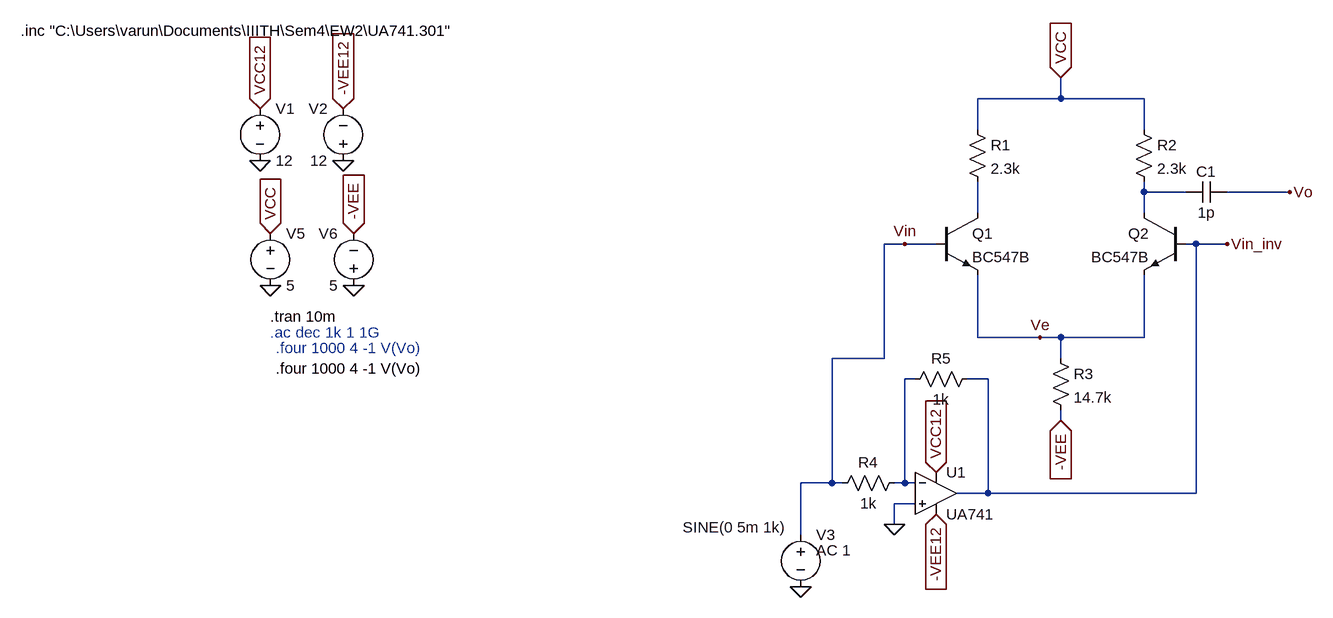
[diagram p0: schematic Preamp_Stage.asc]
Preamp_Stage.asc, the LTspice schematic file:
Version 4
SHEET 1 880 820
WIRE -192 -48 -192 -80
WIRE -192 -48 -320 -48
WIRE -64 -48 -192 -48
WIRE -320 0 -320 -48
WIRE -64 0 -64 -48
WIRE -64 96 -64 80
WIRE 0 96 -64 96
WIRE 160 96 64 96
WIRE -320 128 -320 80
WIRE -64 128 -64 96
WIRE -432 176 -464 176
WIRE -384 176 -432 176
WIRE 16 176 0 176
WIRE 64 176 16 176
WIRE -320 320 -320 224
WIRE -224 320 -320 320
WIRE -192 320 -224 320
WIRE -64 320 -64 224
WIRE -64 320 -192 320
WIRE -464 352 -464 176
WIRE -464 352 -544 352
WIRE -192 352 -192 320
WIRE -416 384 -432 384
WIRE -304 384 -336 384
WIRE -192 448 -192 432
WIRE -544 544 -544 352
WIRE -544 544 -592 544
WIRE -528 544 -544 544
WIRE -432 544 -432 384
WIRE -432 544 -448 544
WIRE -416 544 -432 544
WIRE -304 560 -304 384
WIRE -304 560 -352 560
WIRE 16 560 16 176
WIRE 16 560 -304 560
WIRE -416 576 -448 576
WIRE -448 608 -448 576
WIRE -592 624 -592 544
FLAG -432 176 Vin
FLAG 64 176 Vin_inv
FLAG -224 320 Ve
FLAG -1280 240 0
FLAG -1408 240 0
FLAG -1408 160 VCC
IOPIN -1408 160 In
FLAG -1280 160 -VEE
IOPIN -1280 160 In
FLAG -192 448 -VEE
IOPIN -192 448 In
FLAG -192 -80 VCC
IOPIN -192 -80 In
FLAG 160 96 Vo
FLAG -448 608 0
FLAG -384 592 -VEE12
IOPIN -384 592 In
FLAG -384 528 VCC12
IOPIN -384 528 In
FLAG -592 704 0
FLAG -1296 48 0
FLAG -1424 48 0
FLAG -1424 -32 VCC12
IOPIN -1424 -32 In
FLAG -1296 -32 -VEE12
IOPIN -1296 -32 In
SYMBOL res -336 -16 R0
SYMATTR InstName R1
SYMATTR Value 2.3k
SYMBOL res -80 -16 R0
SYMATTR InstName R2
SYMATTR Value 2.3k
SYMBOL npn -384 128 R0
SYMATTR InstName Q1
SYMATTR Value BC547B
SYMBOL npn 0 128 M0
SYMATTR InstName Q2
SYMATTR Value BC547B
SYMBOL res -208 336 R0
SYMATTR InstName R3
SYMATTR Value 14.7k
SYMBOL voltage -1408 144 R0
SYMATTR InstName V5
SYMATTR Value 5
SYMBOL voltage -1280 256 R180
WINDOW 0 24 96 Left 2
WINDOW 3 24 16 Left 2
SYMATTR InstName V6
SYMATTR Value 5
SYMBOL cap 64 80 R90
WINDOW 0 0 32 VBottom 2
WINDOW 3 32 32 VTop 2
SYMATTR InstName C1
SYMATTR Value 1p
SYMBOL voltage -592 608 R0
WINDOW 123 24 40 Left 2
WINDOW 39 0 0 Left 0
WINDOW 3 -182 4 Left 2
SYMATTR Value2 AC 1
SYMATTR Value SINE(0 5m 1k)
SYMATTR InstName V3
SYMBOL OpAmps\\opamp2 -384 496 R0
SYMATTR InstName U1
SYMATTR Value UA741
SYMBOL res -432 528 R90
WINDOW 0 0 56 VBottom 2
WINDOW 3 32 56 VTop 2
SYMATTR InstName R4
SYMATTR Value 1k
SYMBOL res -320 368 R90
WINDOW 0 0 56 VBottom 2
WINDOW 3 32 56 VTop 2
SYMATTR InstName R5
SYMATTR Value 1k
SYMBOL voltage -1424 -48 R0
SYMATTR InstName V1
SYMATTR Value 12
SYMBOL voltage -1296 64 R180
WINDOW 0 24 96 Left 2
WINDOW 3 24 16 Left 2
SYMATTR InstName V2
SYMATTR Value 12
TEXT -1408 288 Left 2 !.tran 10m
TEXT -1408 312 Left 2 ;.ac dec 1k 1 1G
TEXT -1400 336 Left 2 ;.four 1000 4 -1 V(Vo)
TEXT -1400 368 Left 2 !.four 1000 4 -1 V(Vo)
TEXT -1792 -152 Left 2 !.inc "C:\\Users\\varun\\Documents\\IIITH\\Sem4\\EW2\\UA741.301"

The netlist it stands for:
* Preamp_Stage.asc
R1 VCC N002 2.3k
R2 VCC N001 2.3k
Q1 N002 Vin Ve 0 BC547B
Q2 N001 Vin_inv Ve 0 BC547B
R3 Ve -VEE 14.7k
V5 VCC 0 5
V6 0 -VEE 5
C1 Vo N001 1p
V3 Vin 0 SINE(0 5m 1k) AC 1
XU1 0 N003 VCC12 -VEE12 Vin_inv UA741  ; pins In+ In- V+ V- OUT
R4 N003 Vin 1k
R5 Vin_inv N003 1k
V1 VCC12 0 12
V2 0 -VEE12 12
.model NPN NPN
.model PNP PNP
.lib standard.bjt
.tran 10m
* .ac dec 1k 1 1G
* .four 1000 4 -1 V(Vo)
.four 1000 4 -1 V(Vo)
.inc "C:\Users\varun\Documents\IIITH\Sem4\EW2\UA741.301"
.backanno
.end